# EAGLE schematic PIC32_breakout (EAGLE 5.12)
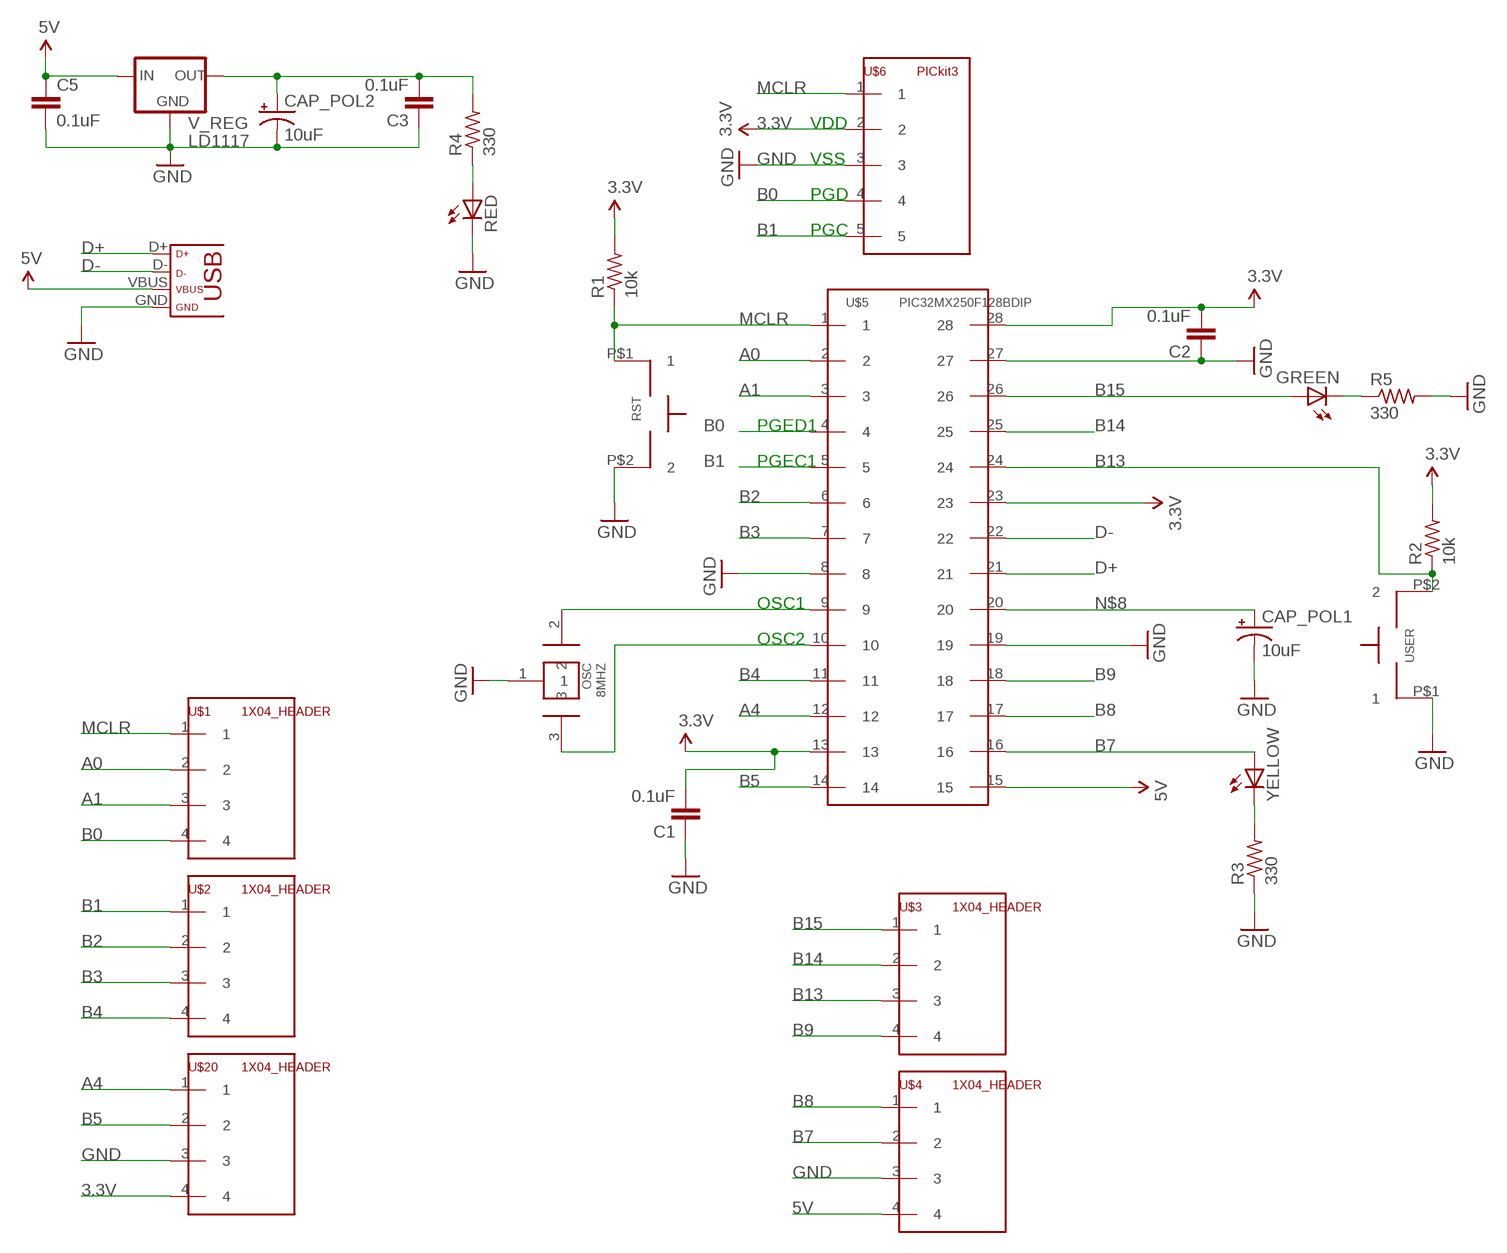
[diagram p0: schematic, sheet 1]

## Parts
8MHZ  OSC  RESONATOR  [RESONATOR]
C1  0.1uF  C-EU025-025X050  [C025-025X050]
C2  0.1uF  C-EU025-025X050  [C025-025X050]
C3  0.1uF  C-EU025-025X050  [C025-025X050]
C5  0.1uF  C-EU025-025X050  [C025-025X050]
CAP_POL1  10uF  CAP_POL  [CAP_POL_D]
CAP_POL2  10uF  CAP_POL  [CAP_POL_D]
GREEN  LED3MM  [LED3MM]
R1  10k  R-US_0207/10  [0207/10]
R2  10k  R-US_0207/10  [0207/10]
R3  330  R-US_0207/10  [0207/10]
R4  330  R-US_0207/10  [0207/10]
R5  330  R-US_0207/10  [0207/10]
RED  LED3MM  [LED3MM]
RST  PUSH_BTN  [PUSH_BTN]
U$1  1X04_HEADER  [1X04]
U$2  1X04_HEADER  [1X04]
U$3  1X04_HEADER  [1X04]
U$4  1X04_HEADER  [1X04]
U$5  PIC32MX250F128BDIP  [2X14]
U$6  PICkit3  1X05_HEADER  [1X05]
U$10  USB  [USB-MINIB]
U$20  1X04_HEADER  [1X04]
USER  PUSH_BTN  [PUSH_BTN]
V_REG  LD1117  [TO220]
YELLOW  LED3MM  [LED3MM]

## Nets
3.3V: C1.2 C2.2 R1.2 R2.2 U$5.13 U$5.23 U$5.28 U$6.2 U$20.4
5V: C5.1 U$4.4 U$5.15 U$10.VBUS V_REG.3(IN)
A0: U$1.2 U$5.2
A1: U$1.3 U$5.3
A4: U$5.12 U$20.1
B0: U$1.4 U$5.4 U$6.4
B1: U$2.1 U$5.5 U$6.5
B2: U$2.2 U$5.6
B3: U$2.3 U$5.7
B4: U$2.4 U$5.11
B5: U$5.14 U$20.2
B7: U$4.2 U$5.16 YELLOW.A
B8: U$4.1 U$5.17
B9: U$3.4 U$5.18
B13: R2.1 U$3.3 U$5.24 USER.P$2
B14: U$3.2 U$5.25
B15: GREEN.A U$3.1 U$5.26
D+: U$5.21 U$10.D+
D-: U$5.22 U$10.D-
GND: 8MHZ.1 C1.1 C2.1 C3.1 C5.2 CAP_POL1.2(-) CAP_POL2.2(-) R3.1 R5.2 RED.K(C) RST.P$2 U$4.3 U$5.8 U$5.19 U$5.27 U$6.3 U$10.GND U$20.3 USER.P$1 V_REG.1(GND)
MCLR: R1.1 RST.P$1 U$1.1 U$5.1 U$6.1
N$1: 8MHZ.2 U$5.9
N$2: 8MHZ.3 U$5.10
N$3: R3.2 YELLOW.K(C)
N$4: GREEN.K(C) R5.1
N$5: R4.1 RED.A
N$7: C3.2 CAP_POL2.1(+) R4.2 V_REG.2(OUT)
N$8: CAP_POL1.1(+) U$5.20

## Notes on the sheet
- VDD
- VSS
- PGD
- PGC
- PGED1
- PGEC1
- OSC1
- OSC2

## Library data of the parts
8MHZ = ME433:RESONATOR
C1-C3 C5 = resistor:C-EU: CAPACITOR, European symbol
CAP_POL1 CAP_POL2 = ME433:CAP_POL
GREEN RED YELLOW = led:LED: LED OSRAM: - CHIPLED LG R971, LG N971, LY N971, LG Q971, LY Q971, LO R971, LY R971 LH N974, LH R974 LS Q976, LO Q976, LY Q976 LO Q996 - Hyper CHIPLED LW Q18S LB Q993, LB Q99A, LB R99A - SideLED LS A670, LO A670, LY A670, LG A670, LP A670 LB A673, LV A673, LT A673, LW A673 LH A674 LY A675 LS A676, LA A676, LO A676, LY A676, LW A676 LS A679, LY A679, LG A679 - Hyper Micro SIDELED® LS Y876, LA Y876, LO Y876, LY Y876 LT Y87S - SmartLED LW L88C, LW L88S LB L89C, LB L89S, LG L890 LS L89K, LO L89K, LY L89K LS L896, LA L896, LO L896, LY L896 - TOPLED LS T670, LO T670, LY T670, LG T670, LP T670 LSG T670, LSP T670, LSY T670, LOP T670, LYG T670 LG T671, LOG T671, LSG T671 LB T673, LV T673, LT T673, LW T673 LH T674 LS T676, LA T676, LO T676, LY T676, LB T676, LH T676, LSB T676, LW T676 LB T67C, LV T67C, LT T67C, LS T67K, LO T67K, LY T67K, LW E67C LS E67B, LA E67B, LO E67B, LY E67B, LB E67C, LV E67C, LT E67C LW T67C LS T679, LY T679, LG T679 LS T770, LO T770, LY T770, LG T770, LP T770 LB T773, LV T773, LT T773, LW T773 LH T774 LS E675, LA E675, LY E675, LS T675 LS T776, LA T776, LO T776, LY T776, LB T776 LHGB T686 LT T68C, LB T68C - Hyper Mini TOPLED® LB M676 - Mini TOPLED Santana® LG M470 LS M47K, LO M47K, LY M47K Source: http://www.osram.convergy.de LUXEON: - LUMILED® LXK2-PW12-R00, LXK2-PW12-S00, LXK2-PW14-U00, LXK2-PW14-V00 LXK2-PM12-R00, LXK2-PM12-S00, LXK2-PM14-U00 LXK2-PE12-Q00, LXK2-PE12-R00, LXK2-PE12-S00, LXK2-PE14-T00, LXK2-PE14-U00 LXK2-PB12-K00, LXK2-PB12-L00, LXK2-PB12-M00, LXK2-PB14-N00, LXK2-PB14-P00, LXK2-PB14-Q00 LXK2-PR12-L00, LXK2-PR12-M00, LXK2-PR14-Q00, LXK2-PR14-R00 LXK2-PD12-Q00, LXK2-PD12-R00, LXK2-PD12-S00 LXK2-PH12-R00, LXK2-PH12-S00 LXK2-PL12-P00, LXK2-PL12-Q00, LXK2-PL12-R00 Source: www.luxeon.com KINGBRIGHT: KA-3528ASYC Source: www.kingbright.com
R1-R5 = resistor:R-US_: RESISTOR, American symbol
RST USER = ME433:PUSH_BTN
U$1-U$4 U$20 = ME433:1X04_HEADER
U$5 = ME433:PIC32MX250F128B
U$6 = ME433:1X05_HEADER
U$10 = ME433:USB
V_REG = ME433:LD1117